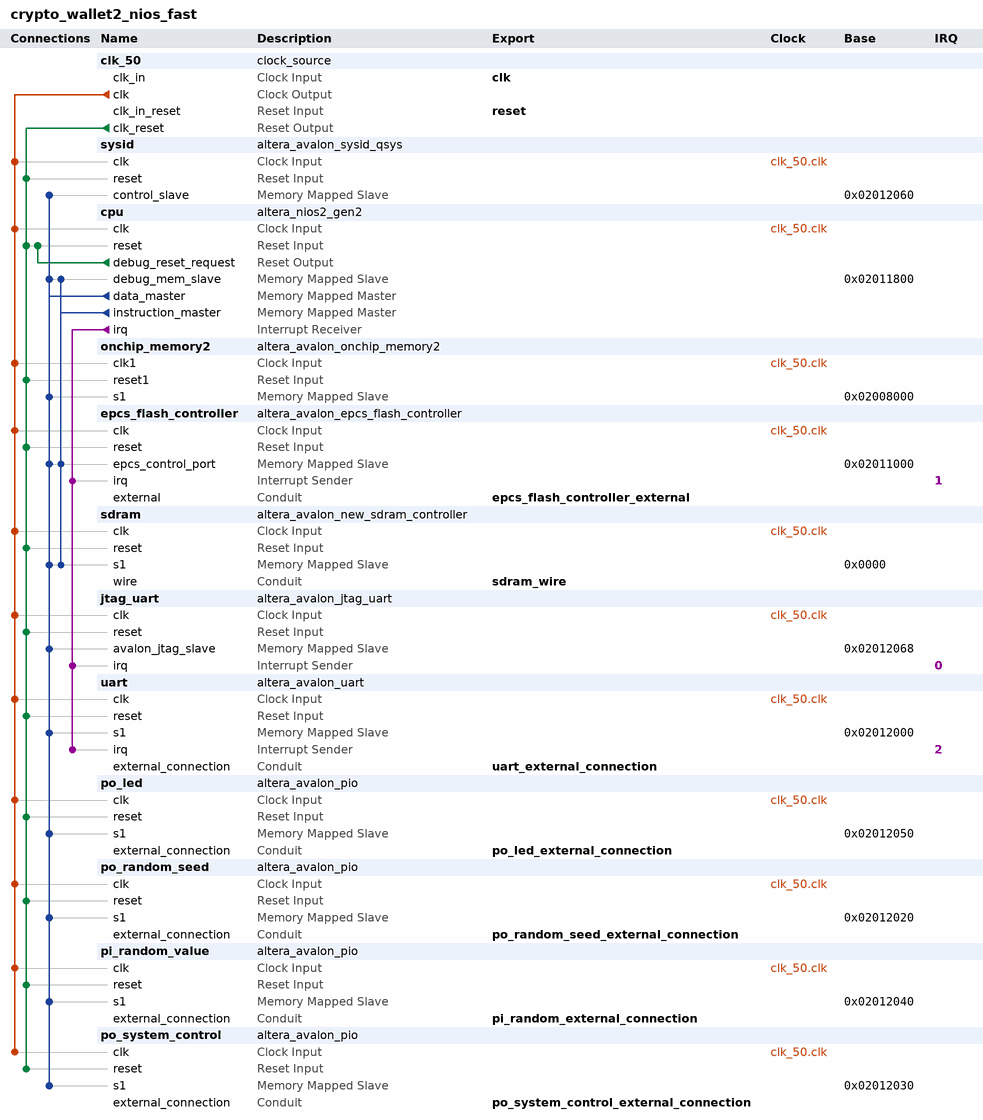
[diagram p0: system contents]
# Platform Designer (Qsys) system crypto_wallet2_nios_fast, Cyclone IV E EP4CE22F17C6
# Parameters at their usual value, and those the tool derives, are not listed.
package require -exact qsys 18.1
create_system crypto_wallet2_nios_fast
set_project_property DEVICE_FAMILY {Cyclone IV E}
set_project_property DEVICE EP4CE22F17C6

add_instance clk_50 clock_source 18.1
set_instance_parameter_value clk_50 clockFrequency 50000000

add_instance sysid altera_avalon_sysid_qsys 18.1
set_instance_parameter_value sysid id 0

add_instance cpu altera_nios2_gen2 18.1
set_instance_parameter_value cpu dcache_size 2048
set_instance_parameter_value cpu exceptionSlave sdram.s1
set_instance_parameter_value cpu icache_size 4096
set_instance_parameter_value cpu impl Fast
set_instance_parameter_value cpu resetSlave sdram.s1

add_instance onchip_memory2 altera_avalon_onchip_memory2 18.1
set_instance_parameter_value onchip_memory2 dataWidth 32
set_instance_parameter_value onchip_memory2 dualPort false
set_instance_parameter_value onchip_memory2 initMemContent true
set_instance_parameter_value onchip_memory2 initializationFileName onchip_mem.hex
set_instance_parameter_value onchip_memory2 memorySize 26000

add_instance epcs_flash_controller altera_avalon_epcs_flash_controller 18.1
set_instance_parameter_value epcs_flash_controller resetrequest_enabled true

add_instance sdram altera_avalon_new_sdram_controller 18.1
set_instance_parameter_value sdram TAC 6.5
set_instance_parameter_value sdram TRCD 20.0
set_instance_parameter_value sdram TRP 20.0
set_instance_parameter_value sdram casLatency 2
set_instance_parameter_value sdram columnWidth 9
set_instance_parameter_value sdram dataWidth 16
set_instance_parameter_value sdram generateSimulationModel false
set_instance_parameter_value sdram initRefreshCommands 8
set_instance_parameter_value sdram model single_Micron_MT48LC4M32B2_7_chip
set_instance_parameter_value sdram numberOfBanks 4
set_instance_parameter_value sdram numberOfChipSelects 1
set_instance_parameter_value sdram powerUpDelay 200.0
set_instance_parameter_value sdram refreshPeriod 0.75
set_instance_parameter_value sdram rowWidth 13

add_instance jtag_uart altera_avalon_jtag_uart 18.1
set_instance_parameter_value jtag_uart simInteractiveOptions NO_INTERACTIVE_WINDOWS

add_instance uart altera_avalon_uart 18.1
set_instance_parameter_value uart baud 9600
set_instance_parameter_value uart dataBits 8
set_instance_parameter_value uart fixedBaud true
set_instance_parameter_value uart parity NONE
set_instance_parameter_value uart stopBits 1

add_instance po_led altera_avalon_pio 18.1
set_instance_parameter_value po_led direction Output
set_instance_parameter_value po_led width 8

add_instance po_random_seed altera_avalon_pio 18.1
set_instance_parameter_value po_random_seed direction Output
set_instance_parameter_value po_random_seed width 32

add_instance pi_random_value altera_avalon_pio 18.1
set_instance_parameter_value pi_random_value direction Input
set_instance_parameter_value pi_random_value width 8

add_instance po_system_control altera_avalon_pio 18.1
set_instance_parameter_value po_system_control direction Output
set_instance_parameter_value po_system_control width 8

# connections
add_connection clk_50.clk cpu.clk clock
add_connection clk_50.clk epcs_flash_controller.clk clock
add_connection clk_50.clk jtag_uart.clk clock
add_connection clk_50.clk onchip_memory2.clk1 clock
add_connection clk_50.clk pi_random_value.clk clock
add_connection clk_50.clk po_led.clk clock
add_connection clk_50.clk po_random_seed.clk clock
add_connection clk_50.clk po_system_control.clk clock
add_connection clk_50.clk sdram.clk clock
add_connection clk_50.clk sysid.clk clock
add_connection clk_50.clk uart.clk clock
add_connection clk_50.clk_reset cpu.reset reset
add_connection clk_50.clk_reset epcs_flash_controller.reset reset
add_connection clk_50.clk_reset jtag_uart.reset reset
add_connection clk_50.clk_reset onchip_memory2.reset1 reset
add_connection clk_50.clk_reset pi_random_value.reset reset
add_connection clk_50.clk_reset po_led.reset reset
add_connection clk_50.clk_reset po_random_seed.reset reset
add_connection clk_50.clk_reset po_system_control.reset reset
add_connection clk_50.clk_reset sdram.reset reset
add_connection clk_50.clk_reset sysid.reset reset
add_connection clk_50.clk_reset uart.reset reset
add_connection cpu.debug_reset_request cpu.reset reset
add_connection cpu.data_master cpu.debug_mem_slave avalon
set_connection_parameter_value cpu.data_master/cpu.debug_mem_slave baseAddress 0x02011800
add_connection cpu.data_master epcs_flash_controller.epcs_control_port avalon
set_connection_parameter_value cpu.data_master/epcs_flash_controller.epcs_control_port baseAddress 0x02011000
add_connection cpu.data_master jtag_uart.avalon_jtag_slave avalon
set_connection_parameter_value cpu.data_master/jtag_uart.avalon_jtag_slave baseAddress 0x02012068
add_connection cpu.data_master onchip_memory2.s1 avalon
set_connection_parameter_value cpu.data_master/onchip_memory2.s1 baseAddress 0x02008000
add_connection cpu.data_master pi_random_value.s1 avalon
set_connection_parameter_value cpu.data_master/pi_random_value.s1 baseAddress 0x02012040
add_connection cpu.data_master po_led.s1 avalon
set_connection_parameter_value cpu.data_master/po_led.s1 baseAddress 0x02012050
add_connection cpu.data_master po_random_seed.s1 avalon
set_connection_parameter_value cpu.data_master/po_random_seed.s1 baseAddress 0x02012020
add_connection cpu.data_master po_system_control.s1 avalon
set_connection_parameter_value cpu.data_master/po_system_control.s1 baseAddress 0x02012030
add_connection cpu.data_master sdram.s1 avalon
set_connection_parameter_value cpu.data_master/sdram.s1 baseAddress 0x0000
add_connection cpu.data_master sysid.control_slave avalon
set_connection_parameter_value cpu.data_master/sysid.control_slave baseAddress 0x02012060
add_connection cpu.data_master uart.s1 avalon
set_connection_parameter_value cpu.data_master/uart.s1 baseAddress 0x02012000
add_connection cpu.instruction_master cpu.debug_mem_slave avalon
set_connection_parameter_value cpu.instruction_master/cpu.debug_mem_slave baseAddress 0x02011800
add_connection cpu.instruction_master epcs_flash_controller.epcs_control_port avalon
set_connection_parameter_value cpu.instruction_master/epcs_flash_controller.epcs_control_port baseAddress 0x02011000
add_connection cpu.instruction_master sdram.s1 avalon
set_connection_parameter_value cpu.instruction_master/sdram.s1 baseAddress 0x0000
add_connection cpu.irq epcs_flash_controller.irq interrupt
set_connection_parameter_value cpu.irq/epcs_flash_controller.irq irqNumber 1
add_connection cpu.irq jtag_uart.irq interrupt
set_connection_parameter_value cpu.irq/jtag_uart.irq irqNumber 0
add_connection cpu.irq uart.irq interrupt
set_connection_parameter_value cpu.irq/uart.irq irqNumber 2

# exported interfaces
add_interface clk clock sink
set_interface_property clk EXPORT_OF clk_50.clk_in
add_interface epcs_flash_controller_external conduit end
set_interface_property epcs_flash_controller_external EXPORT_OF epcs_flash_controller.external
add_interface pi_random_external_connection conduit end
set_interface_property pi_random_external_connection EXPORT_OF pi_random_value.external_connection
add_interface po_led_external_connection conduit end
set_interface_property po_led_external_connection EXPORT_OF po_led.external_connection
add_interface po_random_seed_external_connection conduit end
set_interface_property po_random_seed_external_connection EXPORT_OF po_random_seed.external_connection
add_interface po_system_control_external_connection conduit end
set_interface_property po_system_control_external_connection EXPORT_OF po_system_control.external_connection
add_interface reset reset sink
set_interface_property reset EXPORT_OF clk_50.clk_in_reset
add_interface sdram_wire conduit end
set_interface_property sdram_wire EXPORT_OF sdram.wire
add_interface uart_external_connection conduit end
set_interface_property uart_external_connection EXPORT_OF uart.external_connection

set_interconnect_requirement {$system} qsys_mm.clockCrossingAdapter HANDSHAKE
set_interconnect_requirement {$system} qsys_mm.enableEccProtection FALSE
set_interconnect_requirement {$system} qsys_mm.insertDefaultSlave FALSE
set_interconnect_requirement {$system} qsys_mm.maxAdditionalLatency 1

save_system crypto_wallet2_nios_fast.qsys
